# EAGLE design MBC3_1-4 (EAGLE 9.6.2)
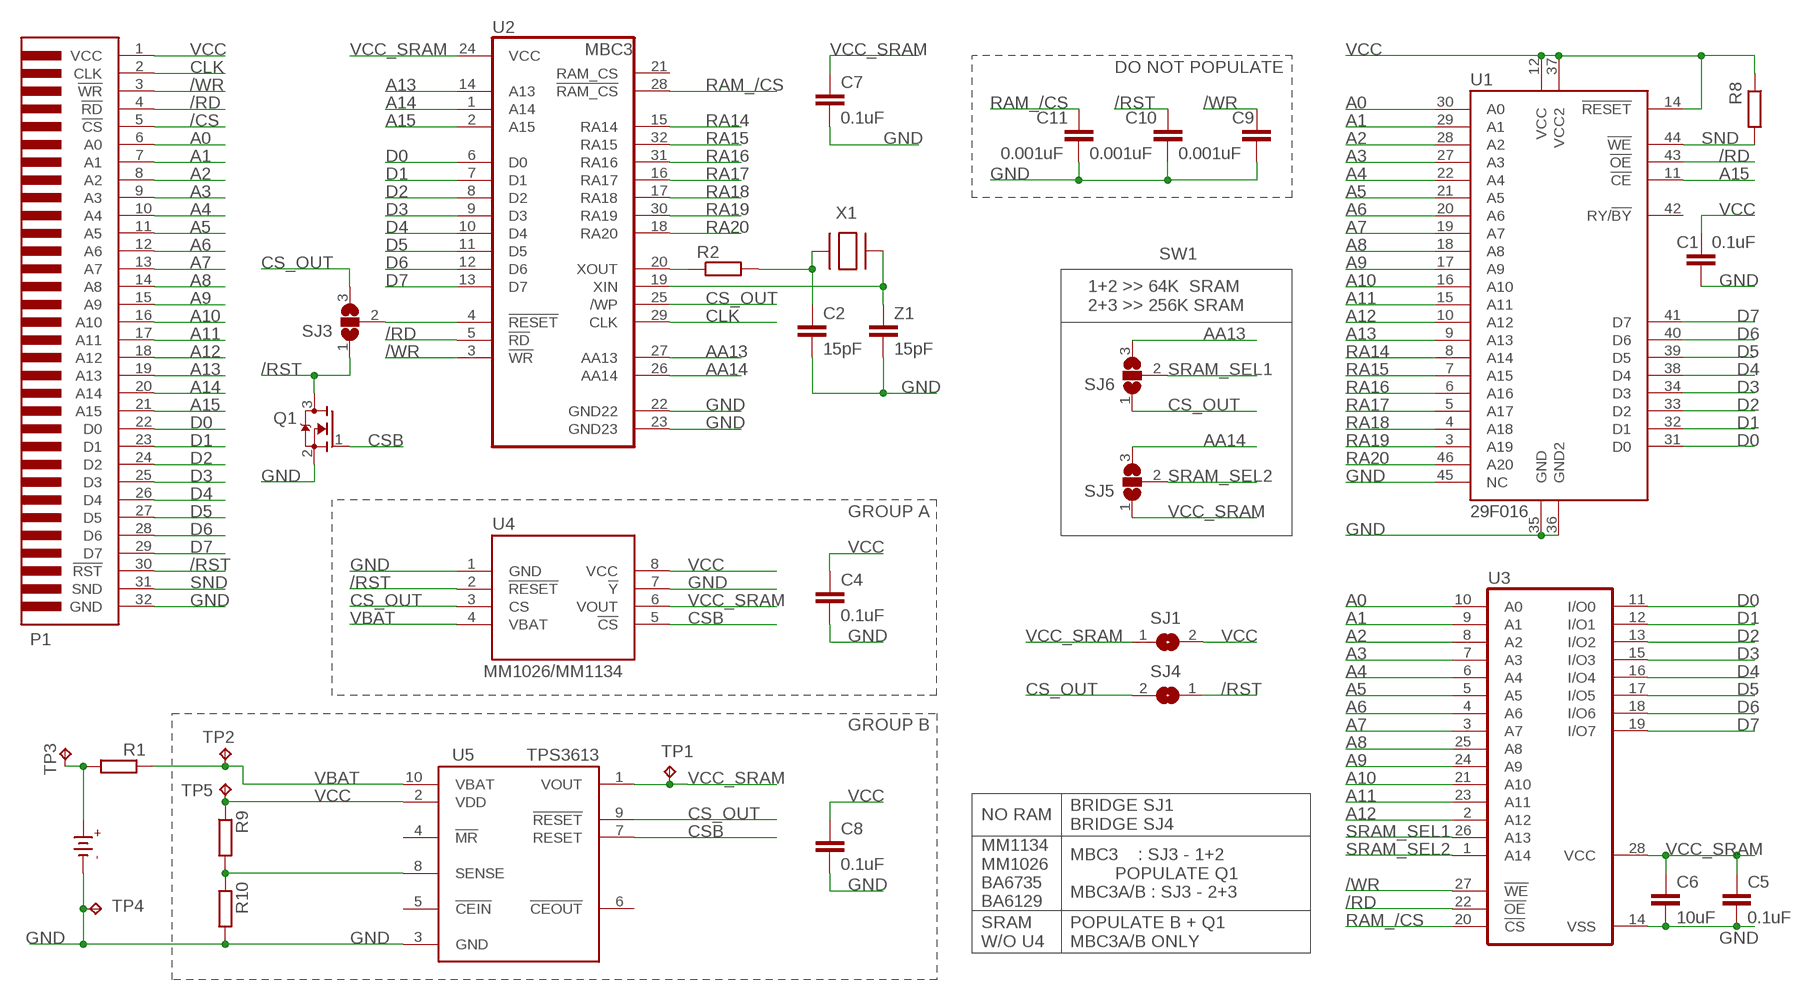
[diagram p0: schematic, sheet 1]

## Parts
B1  CR2025  [CR2025]
C1  0.1uF  C-EUC0603  [C0603]
C2  15pF  C-EUC0603  [C0603]
C4  0.1uF  C-EUC0603  [C0603]
C5  0.1uF  C-EUC0603  [C0603]
C6  10uF  C-EUC0603  [C0603]
C7  0.1uF  C-EUC0603  [C0603]
C8  0.1uF  C-EUC0603  [C0603]
C9  0.001uF  C-EUC0603  [C0603]
C10  0.001uF  C-EUC0603  [C0603]
C11  0.001uF  C-EUC0603  [C0603]
P1  GBC_CARTTAB  [GBC_CART_TABBED]
Q1  2N7002  MOSFET-NREFLOW  [SOT23]
R1  RR0603  [R0603]
R2  RR0603  [R0603]
R8  RR0603  [R0603]
R9  RR0603  [R0603]
R10  RR0603  [R0603]
SJ1  SJ  [SJ]
SJ3  SJ2W  [SJ_2]
SJ4  SJ  [SJ]
SJ5  SJ2W  [SJ_2]
SJ6  SJ2W  [SJ_2]
TP1  TPB1,27  [B1,27]
TP2  TPB1,27  [B1,27]
TP3  TPB1,27  [B1,27]
TP4  TPB1,27  [B1,27]
TP5  TPB1,27  [B1,27]
U1  29F016  [TSOP-48]
U2  MBC3  [QFP-32]
U3  62256_SRAM  [SOP-28L]
U4  MM1134  [SOIC-8]
U5  TPS3613  [MSOP-10]
X1  XTAL-3.2X1.5  [XTAL3215]
Z1  15pF  C-EUC0603  [C0603]

## Nets
/CS: P1.5(!CS)
/RD: P1.4(!RD) U1.43(!OE) U2.5(!RD) U3.22(!OE)
/RST: C10.1 P1.30(!RST) Q1.3(D) SJ3.1 SJ4.1 U4.2(!RESET)
/WR: C9.1 P1.3(!WR) U2.3(!WR) U3.27(!WE)
A0: P1.6(A0) U1.30(A0) U3.10(A0)
A1: P1.7(A1) U1.29(A1) U3.9(A1)
A2: P1.8(A2) U1.28(A2) U3.8(A2)
A3: P1.9(A3) U1.27(A3) U3.7(A3)
A4: P1.10(A4) U1.22(A4) U3.6(A4)
A5: P1.11(A5) U1.21(A5) U3.5(A5)
A6: P1.12(A6) U1.20(A6) U3.4(A6)
A7: P1.13(A7) U1.19(A7) U3.3(A7)
A8: P1.14(A8) U1.18(A8) U3.25(A8)
A9: P1.15(A9) U1.17(A9) U3.24(A9)
A10: P1.16(A10) U1.16(A10) U3.21(A10)
A11: P1.17(A11) U1.15(A11) U3.23(A11)
A12: P1.18(A12) U1.10(A12) U3.2(A12)
A13: P1.19(A13) U1.9(A13) U2.14(A13)
A14: P1.20(A14) U2.1(A14)
A15: P1.21(A15) U1.11(!CE) U2.2(A15)
AA13: SJ6.3 U2.27(AA13)
AA14: SJ5.3 U2.26(AA14)
CLK: P1.2(CLK) U2.29(CLK)
CS_OUT: SJ3.3 SJ4.2 SJ6.1 U2.25(/WP) U4.3(CS) U5.9(!RESET)
CSB: Q1.1(G) U4.5(!CS) U5.7(RESET)
D0: P1.22(D0) U1.31(D0) U2.6(D0) U3.11(I/O0)
D1: P1.23(D1) U1.32(D1) U2.7(D1) U3.12(I/O1)
D2: P1.24(D2) U1.33(D2) U2.8(D2) U3.13(I/O2)
D3: P1.25(D3) U1.34(D3) U2.9(D3) U3.15(I/O3)
D4: P1.26(D4) U1.38(D4) U2.10(D4) U3.16(I/O4)
D5: P1.27(D5) U1.39(D5) U2.11(D5) U3.17(I/O5)
D6: P1.28(D6) U1.40(D6) U2.12(D6) U3.18(I/O6)
D7: P1.29(D7) U1.41(D7) U2.13(D7) U3.19(I/O7)
GND [GND]: B1.- C1.2 C2.2 C4.2 C5.2 C6.2 C7.2 C8.2 C9.2 C10.2 C11.2 P1.32(GND) Q1.2(S) R10.2 TP4.TP U1.35(GND) U1.36(GND2) U1.45(NC) U2.22(GND22) U2.23(GND23) U3.14(VSS) U4.1(GND) U4.7(!Y) U5.3(GND) Z1.2
N$1: SJ3.2 U2.4(!RESET)
N$3 [VCC]: B1.+ R1.2 TP3.TP
N$6: R2.1 U2.20(XOUT)
N$7: C2.1 R2.2 X1.P$2
N$8: U2.19(XIN) X1.P$1 Z1.1
N$10: R9.2 R10.1 U5.8(SENSE)
RA14: U1.8(A14) U2.15(RA14)
RA15: U1.7(A15) U2.32(RA15)
RA16: U1.6(A16) U2.31(RA16)
RA17: U1.5(A17) U2.16(RA17)
RA18: U1.4(A18) U2.17(RA18)
RA19: U1.3(A19) U2.30(RA19)
RA20: U1.46(A20) U2.18(RA20)
RAM_/CS: C11.1 U2.28(!RAM_CS) U3.20(!CS)
SND: P1.31(SND) R8.2 U1.44(!WE)
SRAM_SEL1: SJ6.2 U3.26(A13)
SRAM_SEL2: SJ5.2 U3.1(A14)
VBAT [VCC]: R1.1 TP2.TP U4.4(VBAT) U5.10(VBAT)
VCC [VCC]: C1.1 C4.1 C8.1 P1.1(VCC) R8.1 R9.1 SJ1.2 TP5.TP U1.12(VCC) U1.14(!RESET) U1.37(VCC2) U4.8(VCC) U5.2(VDD)
VCC_SRAM [VCC]: C5.1 C6.1 C7.1 SJ1.1 SJ5.1 TP1.TP U2.24(VCC) U3.28(VCC) U4.6(VOUT) U5.1(VOUT)
Unconnected: U1.42(RY/!BY) U2.21(RAM_CS) U5.4(!MR) U5.5(!CEIN) U5.6(!CEOUT)

## Notes on the sheet
- DO NOT POPULATE
- SW1
- 1+2 >> 64K  SRAM
  2+3 >> 256K SRAM
- GROUP A
- MM1026/MM1134
- GROUP B
- NO RAM
- BRIDGE SJ1
  BRIDGE SJ4
- MM1134
  MM1026
  BA6735
  BA6129
- MBC3    : SJ3 - 1+2
           POPULATE Q1
  MBC3A/B : SJ3 - 2+3
- SRAM
  W/O U4
- POPULATE B + Q1
  MBC3A/B ONLY

## Library data of the parts
B1 = gameboylib:CR2025
C1 C2 C4-C11 Z1 = rcl:C-EU: CAPACITOR, European symbol; SPICEPREFIX: C
P1 = gameboylib:GBC_CART
Q1 = adafruit:MOSFET-N: N-Channel Mosfet 2N7002E - 60V 260mA SOT23 [Digikey: 2N7002ET1GOSTR-ND] - REEL BSH103 - 30V 850mA SOT23 [Digikey: 568-5013-1-ND]
R1 R2 R8-R10 = eagle-ltspice:R: RESISTOR, European symbol; SPICEMODEL: NONE; SPICEPREFIX: R
SJ1 SJ4 = jumper:SJ: SMD solder JUMPER
SJ3 SJ5 SJ6 = jumper:SJ2W: SMD solder JUMPER
TP1-TP5 = testpad:TP: Test pad
U1 = gameboylib:29F016
U2 = gameboylib:MBC3: MBC3; OC_FARNELL: unknown; OC_NEWARK: unknown
U3 = gameboylib:62256_SRAM: MEMORY; MPN: CY62256VNLL-70SNXI; OC_FARNELL: 1650073; OC_NEWARK: 19M2582
U4 = gameboylib:MM1134
U5 = gameboylib:TPS3613
X1 = adafruit:XTAL: Low cost SMT crystals, no capacitors included http://www.ladyada.net/library/eagle

## Net classes
1 VCC: width 0.203 mm
2 GND: width 0.203 mm

## Board
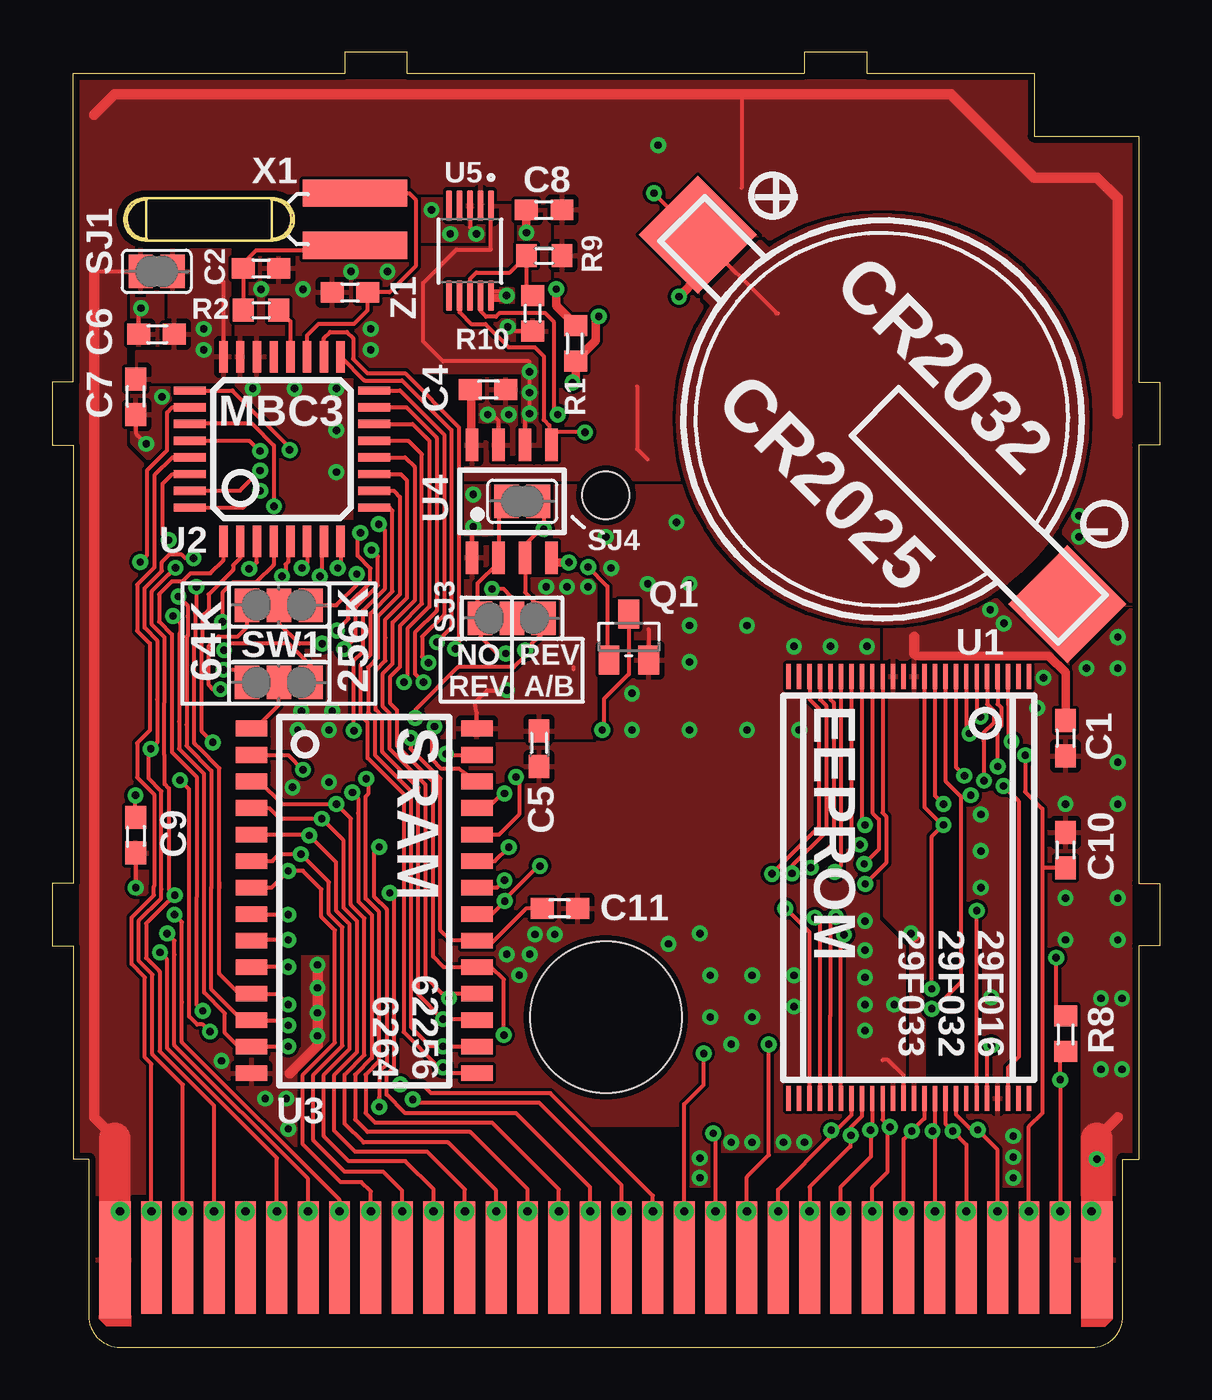
[diagram p1: board, top side]
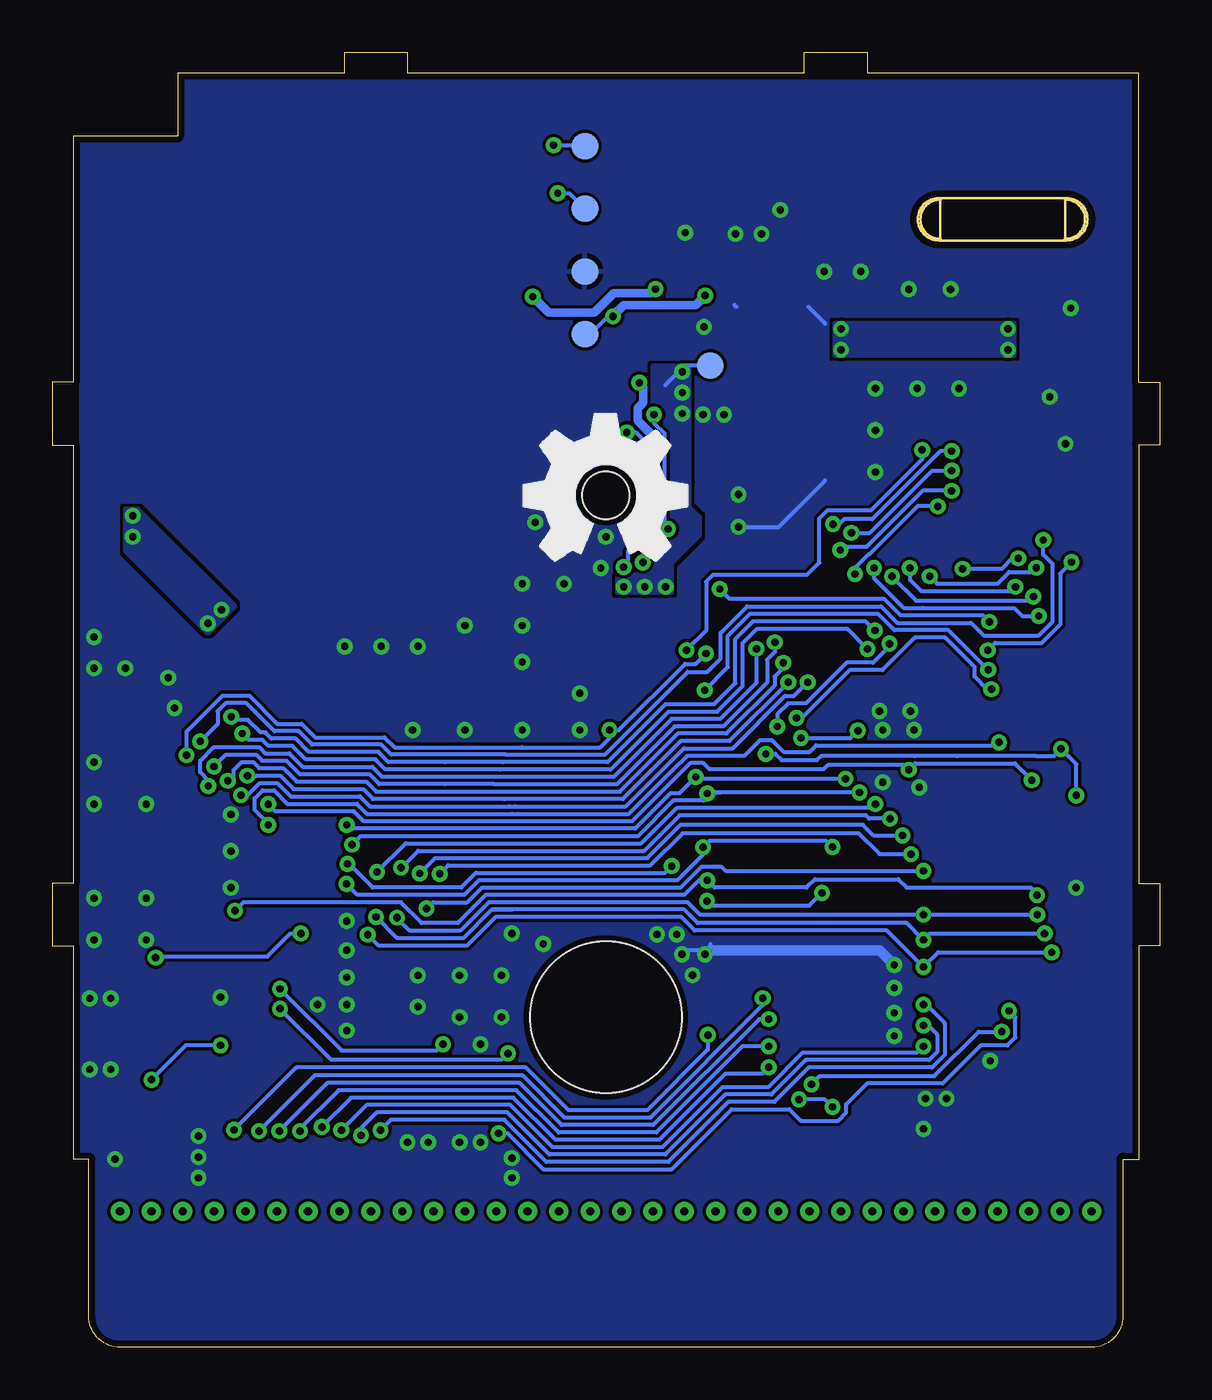
[diagram p2: board, bottom side, seen from below]

Size 53 x 62.01 mm. Coordinates in mm from the lower left corner, seen from the top.
Copper layers (1*16): Top 0.035mm / dielectric 1.5mm / Bottom 0.035mm
Design rules "default *": minimum track width 7mil, minimum drill 13mil, track to track 6mil, track to pad 7mil, pad to pad 7mil, via to via 7mil, smd to smd 5mil, copper to edge 12mil, drill to drill 22mil, minimum pad ring 10mil, minimum via ring 8mil, stop-mask expansion 4mil, vias tented up to drill 14mil, thermal gap 10mil
tKeepout: area -0.8,-1.6 to 55,11; area 0,11 to 3,62; area 50,11 to 53,62; area 3,55.1 to 50,62
tRestrict: area 31.8,8.7 to 36.4,9.2; area 48.4,5.5 to 49.1,15.6; area 11.2,14.4 to 11.8,20.7; area 10.6,21 to 11.3,22.4; area 47.6,0.7 to 50.9,1.2; area 10.5,39 to 14.5,39.5; area 14.5,39.5 to 15,46.5; area 10.1,46.5 to 14.5,47; area 9.3,46.5 to 9.5,48.3; area 10.1,48.1 to 11.9,48.3; area 27.6,6.7 to 34.9,7.6; area 38.8,11.2 to 43.4,12; area 35.1,32.3 to 39.8,32.8; area 46.1,31.4 to 46.9,32; area 35.1,31.4 to 35.9,32; area 35.1,11.9 to 40,12.6; area 11.8,18.9 to 13.2,19.6; area 25.2,10 to 29.9,10.5; area 45.6,7.2 to 46.4,7.6; area 3.5,24.4 to 4.1,24.7; area 9.7,28.9 to 10.4,29.1; area 9.7,27.6 to 10.4,27.9; area 21.8,42.4 to 22.2,42.6; area 23.1,42.4 to 23.4,42.6; area 20.5,43.9 to 20.9,44.1; area 20.5,38.5 to 20.9,38.7; area 23.1,37 to 23.5,37.2; area 45.2,35.3 to 48.8,38.9; area 10.9,60.8 to 42.9,61.3; area 0.7,15 to 1.2,47; area 51.8,14.7 to 52.3,46.7
bRestrict: area 51.8,14.7 to 52.3,46.7; area 0.7,15 to 1.2,47; area 10.9,60.8 to 42.9,61.3

### Footprints (pad centres in the part's own frame; a part is rotated, then mirrored left to right if it is on the bottom)
CR2025 = smd 4 x 4: + -12,0; - 13,0
C0603 = smd 1.1 x 1: 1 -0.85,0; 2 0.85,0
GBC_CART_TABBED = smd 1.5 x 5.6: 1 -23.4,-25.01; 32 23.6,-25.01 | smd 1 x 5.4: 2 -21.65,-24.91; 3 -20.15,-24.91; 4 -18.65,-24.91; 5 -17.15,-24.91; 6 -15.65,-24.91; 7 -14.15,-24.91; 8 -12.65,-24.91; 9 -11.15,-24.91; 10 -9.65,-24.91; 11 -8.15,-24.91; 12 -6.65,-24.91; 13 -5.15,-24.91; 14 -3.65,-24.91; 15 -2.15,-24.91; 16 -0.65,-24.91; 17 0.85,-24.91; 18 2.35,-24.91; 19 3.85,-24.91; 20 5.35,-24.91; 21 6.85,-24.91; 22 8.35,-24.91; 23 9.85,-24.91; 24 11.35,-24.91; 25 12.85,-24.91; 26 14.35,-24.91; 27 15.85,-24.91; 28 17.35,-24.91; 29 18.85,-24.91; 30 20.35,-24.91; 31 21.85,-24.91 | drill 0.4: P$1 -21.65,-22.7; P$2 -18.65,-22.7; P$3 -15.65,-22.7; P$4 -12.65,-22.7; P$5 -9.65,-22.7; P$6 -6.65,-22.7; P$7 -3.65,-22.7; P$8 -0.65,-22.7; P$9 2.35,-22.7; P$10 5.35,-22.7; P$11 8.35,-22.7; P$12 11.35,-22.7; P$13 14.35,-22.7; P$14 17.35,-22.7; P$15 20.35,-22.7; P$16 23.35,-22.7; P$17 21.85,-22.7; P$18 18.85,-22.7; P$19 15.85,-22.7; P$20 12.85,-22.7; P$21 9.85,-22.7; P$22 6.85,-22.7; P$23 3.85,-22.7; P$24 0.85,-22.7; P$25 -2.15,-22.7; P$26 -5.15,-22.7; P$27 -8.15,-22.7; P$28 -11.15,-22.7; P$29 -14.15,-22.7; P$30 -17.15,-22.7; P$31 -20.15,-22.7; P$32 -23.15,-22.7 | hole 7.25: 0.1,-13.41 | hole 2.25: 0.1,11.585
SOT23 = smd 1 x 1.4: 1 -0.95,-1.1; 2 0.95,-1.1; 3 0,1.1
R0603 = smd 1 x 1.1: 1 -0.85,0; 2 0.85,0
SJ = smd 1.168 x 1.6: 1 -0.762,0; 2 0.762,0
SJ_2 = smd 1.168 x 1.6: 1 -1.524,0; 2 0,0; 3 1.524,0
B1,27 = smd 1.27 x 1.27: TP 0,0
TSOP-48 = smd 1.2 x 0.21: 1 -10.1,5.75; 2 -10.1,5.25; 3 -10.1,4.75; 4 -10.1,4.25; 5 -10.1,3.75; 6 -10.1,3.25; 7 -10.1,2.75; 8 -10.1,2.25; 9 -10.1,1.75; 10 -10.1,1.25; 11 -10.1,0.75; 12 -10.1,0.25; 13 -10.1,-0.25; 14 -10.1,-0.75; 15 -10.1,-1.25; 16 -10.1,-1.75; 17 -10.1,-2.25; 18 -10.1,-2.75; 19 -10.1,-3.25; 20 -10.1,-3.75; 21 -10.1,-4.25; 22 -10.1,-4.75; 23 -10.1,-5.25; 24 -10.1,-5.75; 25 10.1,-5.75; 26 10.1,-5.25; 27 10.1,-4.75; 28 10.1,-4.25; 29 10.1,-3.75; 30 10.1,-3.25; 31 10.1,-2.75; 32 10.1,-2.25; 33 10.1,-1.75; 34 10.1,-1.25; 35 10.1,-0.75; 36 10.1,-0.25; 37 10.1,0.25; 38 10.1,0.75; 39 10.1,1.25; 40 10.1,1.75; 41 10.1,2.25; 42 10.1,2.75; 43 10.1,3.25; 44 10.1,3.75; 45 10.1,4.25; 46 10.1,4.75; 47 10.1,5.25; 48 10.1,5.75
QFP-32 = smd 0.4 x 1.524: 1 -2.8,-4.415; 2 -2,-4.415; 3 -1.2,-4.415; 4 -0.4,-4.415; 5 0.4,-4.415; 6 1.2,-4.415; 7 2,-4.415; 8 2.8,-4.415; 17 2.8,4.415; 18 2,4.415; 19 1.2,4.415; 20 0.4,4.415; 21 -0.4,4.415; 22 -1.2,4.415; 23 -2,4.415; 24 -2.8,4.415 | smd 1.524 x 0.4: 9 4.415,-2.8; 10 4.415,-2; 11 4.415,-1.2; 12 4.415,-0.4; 13 4.415,0.4; 14 4.415,1.2; 15 4.415,2; 16 4.415,2.8; 25 -4.415,2.8; 26 -4.415,2; 27 -4.415,1.2; 28 -4.415,0.4; 29 -4.415,-0.4; 30 -4.415,-1.2; 31 -4.415,-2; 32 -4.415,-2.8
SOP-28L = smd 0.75 x 1.5: 1 -7.62,-5.457; 2 -6.35,-5.457; 3 -5.08,-5.457; 4 -3.81,-5.457; 5 -2.54,-5.457; 6 -1.27,-5.457; 7 0,-5.457; 8 1.27,-5.457; 9 2.54,-5.457; 10 3.81,-5.457; 11 5.08,-5.457; 12 6.35,-5.457; 13 7.62,-5.457; 14 8.89,-5.457; 15 8.89,5.33; 16 7.62,5.33; 17 6.35,5.33; 18 5.08,5.33; 19 3.81,5.33; 20 2.54,5.33; 21 1.27,5.33; 22 0,5.33; 23 -1.27,5.33; 24 -2.54,5.33; 25 -3.81,5.33; 26 -5.08,5.33; 27 -6.35,5.33; 28 -7.62,5.33
SOIC-8 = smd 0.6 x 1.55: 1 1.905,2.7; 2 0.635,2.7; 3 -0.635,2.7; 4 -1.905,2.7; 5 -1.905,-2.7; 6 -0.635,-2.7; 7 0.635,-2.7; 8 1.905,-2.7
MSOP-10 = smd 1.47 x 0.28: 1 -2.15,1; 2 -2.15,0.5; 3 -2.15,0; 4 -2.15,-0.5; 5 -2.15,-1; 6 2.15,-1; 7 2.15,-0.5; 8 2.15,0; 9 2.15,0.5; 10 2.15,1
XTAL3215 = smd 1.3 x 5: P$1 1.25,0.5; P$2 -1.25,0.5

### Placement (x,y rotation side)
B1  39.39,44.79 315 top
C1  48.5,29.16 270 top
C2  10,51.66 0 top
C4  20.85,45.86 0 top
C5  23.3,28.66 270 top
C6  5,48.51 180 top
C7  4,45.51 270 top
C8  23.55,54.46 180 top
C9  4,24.51 270 top
C10  48.5,23.81 90 top
C11  24.3,21.01 0 top
P1  26.4,29.21 0 top
Q1  27.6,34.01 0 top
R1  25.05,48.06 90 top
R2  10,49.66 180 top
R8  48.5,15.01 270 top
R9  23.55,52.26 180 top
R10  23,49.51 270 top
SJ1  5,51.51 180 top
SJ3  22,34.91 0 top
SJ4  22.5,40.51 0 top
SJ5  10.85,31.84 0 top
SJ6  10.85,35.53 0 top
TP1  21.5,47.01 0 bottom
TP2  27.5,48.51 0 bottom
TP3  27.5,54.51 0 bottom
TP4  27.5,51.51 0 bottom
TP5  27.5,57.51 0 bottom
U1  41,22.01 270 top
U2  11,43.01 0 top
U3  15,22.01 270 top
U4  22,40.51 180 top
U5  20,52.51 270 top
X1  15,54.01 90 top
Z1  14.25,50.51 180 top

### Tracks (layer width: path | path; a pad name or v marks a point on that pad's centre or on a via)
/RD  (via drill 0.35)
  Top 0.2: P1.4 7.75,11.57 5.14,14.17 5.14,18 4.5,18.64 4.5,20.29 5.58,21.37 5.59,21.37 v5.87,21.64 5.58,21.93 5.58,26.76 5.38,26.96 5.38,28.35 5.37,28.36 5.37,30.88 5.38,30.89 5.38,33.99 4.77,34.6 4.77,36.2 5.58,37.02 5.6,37.02 v5.9,37.32 v5.89,37.33 | U3.22 21.3,22.01 v21.65,22.36 | U2.5 11.3,38.5 11.3,37.62 11.17,37.49 11.17,37.09 v10.99,36.92 | U1.43 v44.25,20.91
  Bottom 0.2: v5.87,21.64 5.87,21.71 6.17,22.01 12.1,22.01 12.5,22.41 16.5,22.41 16.9,22.01 21.3,22.01 v21.65,22.36 22.05,22.36 22.75,21.66 32.25,21.66 33.59,20.32 35.33,20.32 36.32,21.31 43.85,21.31 v44.25,20.91 | v5.9,37.32 6.1,37.12 7.2,37.12 7.75,36.57 10.64,36.57 v10.99,36.92
/RST  (via drill 0.35)
  Top 0.2: P1.30 46.75,10.57 47.39,11.21 47.39,23.02 47.39,25.78 46.57,26.6 v46.57,28.35 46.65,28.27 | v21.71,33.22 21.29,33.22 20.5,34.01 20.5,34.89 SJ3.1 20.35,35.04 20.35,36.56 21.36,37.58 U4.2 21.36,40.14 SJ4.1 | Q1.3 27.6,32.23 26.4,31.04 26.4,29.63 v26.32,29.55
  Top 0.203: C10.1 47.45,22.96 47.39,23.02
  Bottom 0.2: v46.57,28.35 46.57,29.47 44.85,31.2 43.56,31.2 42.22,29.85 41.06,29.85 40.42,29.21 37.1,29.21 36.62,28.73 30.52,28.73 30.51,28.72 26.78,28.72 26.32,29.18 v26.32,29.55 25.87,29.55 22.71,32.72 22.21,32.72 v21.71,33.22
/WR  (via drill 0.35)
  Top 0.2: v18.85,28.41 18.9,28.36 U3.27 | P1.3 6.25,12.57 4.79,14.03 4.79,17.85 4.15,18.49 4.15,20.43 5.21,21.5 5.21,21.92 5.23,21.93 5.23,26.62 4.61,27.24 4.61,28.55 v4.71,28.65 5.02,28.96 5.02,31.03 5.02,33.84 4.42,34.45 4.42,36.35 5.24,37.18 5.24,37.59 5.63,37.98 6.17,37.98 6.37,37.78 v6.76,37.78 | U2.3 9.8,37.59 9.45,37.25 v9.43,37.27
  Top 0.203: C9.1 3.98,25.38 v3.98,26.43
  Bottom 0.2: 18.85,28.36 v18.85,28.41 18.39,28.41 18.09,28.11 16.4,28.11 16.2,28.31 11.73,28.31 11.72,28.31 9.7,28.31 5.89,28.31 | v6.76,37.78 7.04,37.78 7.55,37.27 v9.43,37.27 | v3.98,26.43 3.98,27.92 v4.71,28.65 5.06,28.31 5.89,28.31 | 5.89,28.31
A0  (via drill 0.35)
  Top 0.2: P1.6 10.75,9.06 5.5,14.32 5.5,18.57 v5.16,18.91 | v11.3,18.21 9.8,18.21 U3.10 | v37.9,19.75 37.75,19.6 U1.30
  Bottom 0.2: v11.3,18.21 10.6,18.91 v5.16,18.91 | v37.9,19.75 37.4,19.25 33.13,19.25 32.69,19.7
  Bottom 0.203: v11.3,18.21 13.04,19.95 22.25,19.95 22.9,20.6 31.78,20.6 32.69,19.7
A1  (via drill 0.35)
  Top 0.2: v11.3,19.51 9.83,19.51 U3.9 | v37.5,20.61 37.24,20.35 37.24,15.88 37.25,15.88 U1.29 | P1.7 12.25,8.06 5.85,14.46 5.85,18.81 5.85,19.46 v5.5,19.81
  Bottom 0.2: v11.3,19.51 11,19.81 v5.5,19.81 | v37.5,20.61 36.5,19.61 33.3,19.61 31.95,20.96 31,20.96
  Bottom 0.203: v11.3,19.51 12.1,20.31 22.1,20.31 22.75,20.96 31,20.96 31.95,20.96
A2  (via drill 0.35)
  Top 0.2: P1.8 13.75,7.06 6.2,14.61 6.2,16.53 6.2,20.36 v5.85,20.71 | v11.3,20.71 9.82,20.71 U3.8 | v36.5,20.57 36.56,20.57 36.75,20.38 U1.28
  Bottom 0.2: v5.85,20.71 v11.3,20.71 21.98,20.71 22.58,21.31 32.1,21.31 33.44,19.97 35.9,19.97 v36.5,20.57
A3  (via drill 0.35)
  Top 0.2: P1.9 15.25,7.46 14.8,7.91 13.8,7.91 12,9.71 12,13.05 13.53,14.58 13.53,19.96 12.89,20.61 12.89,21.92 12,22.81 v11.3,22.81 10.5,22.01 U3.7 | v35.09,21.01 35.12,21.01 36.25,19.87 U1.27
  Bottom 0.2: v35.09,21.01 34.78,21.31 33.13,21.31 32.42,22.01 22.92,22.01 21.92,23.02 20.98,23.02 20.77,22.81 v11.3,22.81
A4  (via drill 0.35)
  Top 0.2: P1.10 16.75,7.5 15.84,8.41 14,8.41 12.5,9.91 12.5,13.05 13.89,14.43 13.89,20.11 13.24,20.75 13.24,22.27 v11.9,23.61 | v34.45,22.67 36.69,24.91 36.69,30.58 36.25,31.02 U1.22
  Top 0.203: U3.6 10.54,23.28 10.87,23.61 v11.9,23.61
  Bottom 0.2: 11.8,23.51 v11.9,23.61 13.4,23.61 14.4,24.61 22.83,24.61 24.37,23.07 34.05,23.07 v34.45,22.67
A5  (via drill 0.35)
  Top 0.2: P1.11 18.25,7.56 16.9,8.91 14.2,8.91 13,10.11 13,13.05 14.24,14.29 14.24,20.25 13.59,20.9 13.59,23.22 v12.3,24.51 | v35.41,22.69 35.41,23.04 37.05,24.68 37.05,30.72 36.75,31.02 U1.21
  Top 0.203: U3.5 12.26,24.55 v12.3,24.51
  Bottom 0.2: v12.3,24.51 13.7,24.51 14.2,25.01 22.93,25.01 24.52,23.42 34.67,23.42 v35.41,22.69
A6  (via drill 0.35)
  Top 0.2: P1.12 19.75,7.56 17.95,9.36 14.5,9.36 13.5,10.36 13.5,13.05 14.59,14.14 14.59,20.4 13.94,21.05 13.94,24.27 v12.9,25.31 | v36.31,22.96 36.31,23.06 37.4,24.15 37.4,30.87 37.25,31.02 U1.20
  Top 0.203: U3.4 10.39,25.82 10.9,25.31 v12.9,25.31
  Bottom 0.2: v12.9,25.31 13.9,25.31 14.06,25.47 22.97,25.47 24.66,23.78 35.49,23.78 v36.31,22.96
A7  (via drill 0.35)
  Top 0.2: P1.13 21.25,7.51 18.95,9.81 14.9,9.81 14,10.71 14,13.05 14.94,14 14.94,20.54 14.29,21.19 14.29,25.32 v13.6,26.01 | v37.46,22.76 37.75,23.05 U1.19
  Top 0.203: U3.3 9.92,27.09 11,26.01 v13.6,26.01
  Bottom 0.2: v13.6,26.01 13.79,25.82 23.12,25.82 24.81,24.13 36.09,24.13 v37.46,22.76
A8  (via drill 0.35)
  Top 0.2: P1.14 22.75,7.56 20,10.31 15.1,10.31 14.5,10.91 14.5,13.05 15.29,13.85 15.29,20.69 14.65,21.34 14.65,25.56 14.65,26.29 v14.37,26.57 | U3.25 20.85,25.82 21.55,26.52 v21.65,26.52 | v38.66,24.06 38.25,24.47 U1.18
  Bottom 0.2: 21,26.57 21.44,26.57 21.84,26.17 23.27,26.17 24.95,24.48 38.23,24.48 v38.66,24.06
  Bottom 0.203: v14.37,26.57 21,26.57 21.6,26.57 v21.65,26.52
A9  (via drill 0.35)
  Top 0.2: P1.15 24.25,7.56 21.05,10.76 15.45,10.76 | U3.24 21.39,24.55 22.35,25.51 22.35,27.16 v22.2,27.31 | 15,11.24 15,13.06 15.65,13.7 15.65,20.84 15,21.48 15,26.01 | v38.91,25.01 38.75,25.17 U1.17
  Top 0.203: 15,25.71 15,26.01 15,26.37 15.12,26.49 15.12,27.13 v15.03,27.22 | 15,11.24 15,11.21 15.45,10.76
  Bottom 0.2: v22.2,27.31 22.99,26.52 23.41,26.52 25.1,24.83 38.73,24.83 v38.91,25.01
  Bottom 0.203: v15.03,27.22 22.11,27.22 v22.2,27.31
A10  (via drill 0.35)
  Top 0.2: P1.16 25.75,7.66 22.2,11.21 16.9,11.21 16,12.11 16,13.06 16.36,13.42 16.36,21.55 v16.16,21.75 | U3.21 20.09,20.75 21.07,20.75 21.66,21.35 | v23.35,23.04 23.26,23.04 21.66,21.45 v21.66,21.37 | v38.86,23.15 39.56,23.85 39.56,25.28 39.25,25.59 U1.16
  Top 0.203: v21.66,21.37 21.66,21.35
  Bottom 0.2: v23.35,23.04 23.67,22.72 32.72,22.72 33.42,22.02 37.66,22.02 38.79,23.15 v38.86,23.15
  Bottom 0.203: v16.16,21.75 16.76,21.15 21.46,21.15 21.46,21.17 v21.66,21.37
A11  (via drill 0.35)
  Top 0.2: P1.17 27.25,7.76 23.3,11.71 17.41,11.71 v17.26,11.87 | v38.92,22.18 39.91,23.18 39.91,25.43 39.75,25.59 U1.15 | v15.66,23.95 15.66,23.93 15.4,23.68 15.4,21.58 16,20.98 16,13.56 15.65,13.21 15.65,11.96 15.66,11.96 v15.66,11.51
  Top 0.203: U3.23 21.19,23.28 v21.85,23.94
  Bottom 0.2: v15.66,11.51 16.01,11.87 v17.26,11.87 | v38.92,22.18 38.4,21.66 33.27,21.66 32.57,22.37 23.07,22.37 21.85,23.59 v21.85,23.94
  Bottom 0.203: v15.66,23.95 15.96,24.26 21.54,24.26 v21.85,23.94
A12  (via drill 0.35)
  Top 0.2: P1.18 28.75,7.26 23.85,12.16 18.13,12.16 17.7,12.59 v16.66,12.59 | U3.2 11.29,28.36 v12,27.65 | v42.66,26.01 42.25,26.42 U1.10 | v7.56,15.11 7.21,15.45 6.94,15.45 6.55,15.84 6.55,16.38 6.56,16.39 6.56,26.72 v6.12,27.15
  Bottom 0.2: v16.66,12.59 16.26,12.99 10.78,12.99 8.66,15.11 v7.56,15.11 | 12.23,27.88 v12,27.65 11.7,27.95 6.92,27.95 v6.12,27.15 | 23.18,27.26 22.47,27.97 21.83,27.97 | 25.25,25.19 38.08,25.19
  Bottom 0.203: 12.23,27.88 15.88,27.88 16.08,27.68 21.54,27.68 21.83,27.97 | 23.18,27.26 25.25,25.19 | v42.66,26.01 42.31,25.67 38.56,25.67 38.08,25.19
A13  (via drill 0.35)
  Top 0.2: P1.19 30.25,11.63 31.18,12.57 v31.18,14.07 | v42.1,16.21 42.23,16.21 43.51,17.49 43.51,26.36 42.75,27.12 U1.9 | 17,34.41 17,32.01 v16.84,31.85
  Top 0.203: 43.51,26.36 43.89,26.36 v43.97,26.43 | U2.14 17.25,44.21 18.05,43.41 18.05,35.46 17,34.41
  Bottom 0.2: v31.18,14.07 31.49,13.76 39.65,13.76 v42.1,16.21 | 31.1,25.9 30.85,25.9 25.54,25.9 22.77,28.68 20.44,28.68 17.93,31.19 17.5,31.19 v16.84,31.85
  Bottom 0.203: v43.97,26.43 43.66,26.43 43.07,27.02 42.24,27.02 41.59,26.38 38.27,26.38 37.79,25.9 31.1,25.9
A14  (via drill 0.35)
  Top 0.2: 6.91,16.41 v7.21,16.11 | 6.91,21.54 6.91,27.32 5.72,28.5 5.72,30.1 5.73,30.1 5.73,34.14 5.12,34.74 5.12,36.06 5.73,36.67 6.23,36.67 6.63,37.07 7.57,37.07 8.2,37.7 U2.1
  Top 0.203: P1.20 31.75,10.13 v31.64,10.24 | 6.91,16.41 6.91,21.54
  Bottom 0.2: 14,12.63 10.38,12.63 8.56,14.45 7.28,14.45 6.9,14.84 6.9,15.8 v7.21,16.11
  Bottom 0.203: v31.64,10.24 31.61,10.26 31.23,10.26 29.49,8.52 23.36,8.52 20.49,11.4 17.71,11.4 17.17,10.85 15.38,10.85 15,11.24 15,11.64 14,12.63
A15  (via drill 0.35)
  Top 0.2: P1.21 33.25,8.16 34.3,9.21 v34.3,14.51 | 42.6,25.01 41.75,25.86 U1.11 | 42.6,25.01 42.6,24.96 42.1,24.46 v42.1,17.16 | 42.6,25.01 v42.66,25.01 | U2.2 9,37.8 8.66,37.45 8.66,37.24 | 7.49,35.31 7.19,35.01 7.19,33.77 7.14,33.72 7.14,29.52
  Top 0.203: 8.66,37.24 8.66,37.22 7.49,36.05 7.49,35.31 | 7.14,29.52 v7.69,28.97
  Bottom 0.2: v42.1,17.16 39.15,14.21 34.6,14.21 v34.3,14.51 | v42.66,25.01 42.66,25.08 43.31,25.74 43.31,26.28 42.93,26.67 42.38,26.67 41.74,26.02 38.42,26.02 37.94,25.54 31,25.54 | 18.55,29.07 18,28.51 16.74,28.51 16.44,28.82 7.83,28.82 v7.69,28.97
  Bottom 0.203: 18.55,29.07 19.12,29.07 19.87,28.32 22.62,28.32 23.32,27.62 25.4,25.54 30.7,25.54 31,25.54
AA13  (via drill 0.35)
  Top 0.2: v14.57,37.03 14.57,36.51 13.6,35.53 SJ6.3 | U2.27 9.57,44.22 10.61,43.18 v10.61,40.28 v10.61,40.27
  Bottom 0.2: v10.61,40.27 11.58,40.27 13.89,37.97 13.94,37.97 14.57,37.33 v14.57,37.03
AA14  (via drill 0.35)
  Top 0.2: SJ5.3 12.36,31.85 12.36,32.66 11.33,33.69 8.53,33.69 v8.22,33.38 | U2.26 5.75,45.01 5.5,44.76 5.5,42.96 4.54,42 4.54,37.92 v4.21,37.59
  Bottom 0.2: v8.22,33.38 7.87,33.73 5.64,33.73 4.76,34.61 4.76,37.05 v4.21,37.59
CLK
  Top 0.2: P1.2 4.75,13.57 4.44,13.88 4.44,17.7 3.79,18.35 3.79,20.58 4.86,21.65 4.86,22.06 4.88,22.08 4.88,26.47 4.06,27.29 4.06,28.93 4.67,29.54 4.67,31.18 4.67,33.7 4.06,34.31 4.06,36.52 4.89,37.35 4.89,41.75 5.75,42.61 U2.29
CS_OUT  (via drill 0.35)
  Top 0.2: 22.64,38.41 U4.3 | 23.52,35.34 23.52,35.26 | 23.52,35.26 SJ3.3 23.52,34.26 v22.64,33.38 22.64,33.11 22.1,32.56 19.42,32.56 17.38,30.52 v17.38,30.13 | U2.25 8.63,45.81 11.36,43.07 v11.36,42.97 | U4.3 22.64,38.42 23.43,39.22 23.43,39.26 23.45,39.26 v23.53,39.18 23.53,40.24 SJ4.2 | v24.2,44.66 24,44.86 24,49.11 23.6,49.51 21.4,49.51 21.23,49.35 20.77,49.35 20.5,49.61 U5.9 | U4.3 22.64,36.15 23.52,35.26 | 7.49,33.43 7.49,33.57 7.96,34.04 8.88,34.04 9.33,34.49 9.33,35.26
  Top 0.203: 9.33,35.26 SJ6.1 | 7.49,33.43 7.49,31.71 7.7,31.51 v8.05,31.51
  Bottom 0.2: v11.36,42.97 11.36,42.54 13.83,40.07 15.9,40.07 16.29,39.68 16.29,37.57 16.88,36.98 21.38,36.98 21.71,36.65 21.71,34.31 v22.64,33.38 | v8.05,31.51 8.25,31.51 8.85,32.11 8.85,32.57 10.26,33.98 11.71,33.98 13.27,32.42 14.83,32.42 17.12,30.13 v17.38,30.13 | v23.53,39.18 23.69,39.34 23.69,43.75 24.2,44.26 v24.2,44.66
CSB  (via drill 0.35)
  Top 0.2: Q1.1 26.57,32.98 26.57,36.44 v25.65,37.36 | v25.5,43.81 24.08,43.81 23.91,43.64 U4.5 23.8,43.21 23.8,44.13 23.52,44.41 23.52,47.46 23.1,47.88 21.84,47.88 20.73,49 20.07,49 19.5,49.56 U5.7
  Bottom 0.2: v25.5,43.81 25.07,43.81 24.6,43.34 24.6,39.96
  Bottom 0.203: v25.65,37.36 25.45,37.56 25.45,38.11 25.1,38.46 25.1,39.46 24.6,39.96
D0  (via drill 0.35)
  Top 0.2: U3.11 10.78,16.93 v11.3,16.41 | P1.22 34.75,7.55 37.29,10.09 v37.29,10.39 37.53,10.39 38.25,11.11 U1.31 | 8,22.01 8,27.72 7.03,28.7 | U2.6 12.2,37.56 v11.95,37.31 | v6.9,36.41 6.99,36.32 | 6.84,35.17 6.84,35.16 6.84,33.92 6.79,33.87 6.79,29.67 6.78,29.66 6.78,28.94 6.83,28.9
  Top 0.203: U3.11 8.95,16.93 8,17.88 8,22.01 8,22.25 | v6.9,36.41 6.9,35.23 6.84,35.17 6.83,35.16 | 6.83,28.9 7.03,28.7
  Bottom 0.2: v11.3,16.41 11.17,16.41 10.29,15.53 10.29,13.99 10.88,13.4 16.78,13.4 18.44,11.75 20.63,11.75 23.5,8.88 29.35,8.88 31.36,10.9 36.79,10.9 v37.29,10.39 | v11.95,37.31 11.95,36.76 11.4,36.21 7.1,36.21 v6.9,36.41
D1  (via drill 0.35)
  Top 0.2: U3.12 11.05,15.66 v11.3,15.41 | P1.23 36.25,7.67 38.2,9.62 38.2,10.12 v38.23,10.14 38.23,10.54 38.75,11.06 U1.32 | 7.62,22.01 7.62,27.61 6.43,28.8 6.43,29.81 6.43,34.02 6.48,34.06 6.48,35 6.48,35.01 6.48,35.51 v6.04,35.95 | v12.81,36.91 12.9,36.91 12.9,38.5 U2.7
  Top 0.203: U3.12 9.09,15.66 7.62,17.13 7.62,22.01 7.62,22.03
  Bottom 0.2: v11.3,15.41 11.07,15.41 10.64,14.98 10.64,14.14 11.03,13.75 16.93,13.75 18.58,12.1 20.78,12.1 23.65,9.23 29.2,9.23 31.22,11.25 37.47,11.25 38.23,10.49 v38.23,10.14 | v12.81,36.91 11.65,35.75 6.34,35.75 6.14,35.95 v6.04,35.95
D2  (via drill 0.35)
  Top 0.2: P1.24 37.75,7.69 39.18,9.12 39.18,10.38 v39.16,10.4 39.25,10.49 U1.33 | U3.13 11.28,14.39 v11.3,14.41 | 7.26,21.78 7.26,27.46 6.08,28.65 6.08,29.95 6.08,29.96 6.08,34.16 6.12,34.2 6.12,34.67 v5.78,35.02 | U2.8 13.8,37.44 v13.67,37.31
  Top 0.203: U3.13 8.92,14.39 8.27,15.04 8.27,15.98 7.26,16.98 7.26,21.78
  Bottom 0.2: v11.3,14.41 11.6,14.11 17.07,14.11 18.73,12.45 20.93,12.45 23.8,9.58 29.05,9.58 31.07,11.6 37.96,11.6 v39.16,10.4 | v5.78,35.02 6.58,35.02 6.96,35.39 11.35,35.39 11.35,35.4 12.24,35.4 13.67,36.82 v13.67,37.31
D3  (via drill 0.35)
  Top 0.2: U3.15 18.99,13.12 v18.7,13.41 | P1.25 39.25,7.66 39.97,8.38 39.97,10.42 v40.09,10.55 39.75,10.89 U1.34 | 18.5,13.41 16.81,15.1 16.81,26.5 15.1,28.22 15.1,29.92 14.77,30.24 14.77,32.7 15.24,33.17 15.24,33.68 15.24,35.14 16.29,36.19 16.29,40.06 16.14,40.21 U2.9
  Top 0.203: v18.7,13.41 18.5,13.41
  Bottom 0.2: v18.7,13.41 19,13.11 20.77,13.11 23.94,9.94 28.91,9.94 30.93,11.95 38.69,11.95 v40.09,10.55
D4  (via drill 0.35)
  Top 0.2: U3.16 18.72,14.39 v18.7,14.41 | P1.26 40.75,9.97 v41.14,10.35 v41.15,10.35 41.75,10.96 U1.38 | U2.10 16.35,41.01 16.64,40.72 16.64,36.05 15.59,35 15.59,33.83 15.59,33.82 15.59,33.02 15.12,32.56 15.12,30.39 15.45,30.06 15.45,28.36 17.17,26.64
  Top 0.203: v18.7,14.41 18.1,14.41 17.17,15.34 17.17,26.64
  Bottom 0.2: v18.7,14.41 19.97,14.41 24.09,10.29 28.76,10.29 30.78,12.31 39.29,12.31 41.15,10.45 v41.15,10.35
D5  (via drill 0.35)
  Top 0.2: U3.17 20.03,15.71 v18.7,15.71 17.52,16.89 17.52,26.79 15.8,28.51 15.8,30.21 15.48,30.53 15.48,32.41 15.94,32.88 15.94,33.97 15.94,34.85 16.99,35.9 16.99,41.51 16.69,41.81 U2.11 | P1.27 42.25,10.23 v42.13,10.35 42.25,10.48 U1.39
  Bottom 0.2: v18.7,15.71 19.16,15.71 24.23,10.64 28.62,10.64 30.63,12.66 39.83,12.66 v42.13,10.35
D6  (via drill 0.35)
  Top 0.2: v18.99,16.72 19.19,16.92 U3.18 18.68,16.93 17.88,17.73 17.88,26.93 16.15,28.66 16.15,30.36 15.83,30.68 15.83,32.27 16.3,32.73 16.3,34.12 16.29,34.12 16.29,34.7 17.34,35.75 17.34,42.16 16.89,42.61 U2.12 | P1.28 43.75,9.7 v43.1,10.35 42.75,10.7 U1.40
  Bottom 0.2: v18.99,16.72 18.99,16.38 24.38,10.99 28.47,10.99 30.49,13.01 40.44,13.01 v43.1,10.35
D7  (via drill 0.35)
  Top 0.2: P1.29 45.25,4.9 45.23,4.92 45.23,9.48 v44.3,10.41 44,10.41 43.25,11.16 U1.41 | v21.62,14.95 21.62,17.6 21.02,18.2 U3.19 18.74,18.2 18.23,18.71 18.23,27.08 16.51,28.8 16.51,30.5 16.18,30.83 16.18,32.12 16.65,32.59 16.65,34.26 16.65,34.56 17.7,35.61 17.7,42.76 17.05,43.41 U2.13
  Bottom 0.2: v21.62,14.95 21.62,14.25 24.52,11.35 28.28,11.35 30.33,13.4 41.31,13.4 v44.3,10.41
GND  (via drill 0.35)
  Top 0.203: U4.1 20.09,39.28 v20.15,39.28 | C9.2 v4,22.01 | 28.55,34.39 Q1.2 | C6.2 4.15,49.66 v4.25,49.76 | R10.2 21.99,48.66 v21.8,48.85 | U4.7 21.36,44.34 21.05,44.66 v20.85,44.66 | U5.3 20,53.61 v20.3,53.31 | v4.5,43.26 4,43.76 C7.2 | U1.36 40.75,13.01 40,13.76 39.75,13.76
  Top 0.4: B1.- 48.35,35.51 48.35,34.71 | C8.2 v22.7,53.37
  Top 0.5: 50,10.01 51,11.01 | v12.7,18.31 12.7,14.46 11.36,13.12
  Top 1.5: P1.32 50,10.01
  Bottom 0.203: 21.5,19.3 21.5,19.01 22.86,19.01 v22.86,18.82 | v20.15,39.28 18.23,39.28 16,41.51 | 16,49.01 16.8,49.81 | 20.25,49.81 20.35,49.91
  Bottom 0.5: v12.7,18.31 13.4,19.01 21.5,19.01
  other vias: 12.7,17.21 12.7,16.01 12.7,14.91 8.1,13.71 10.2,11.91 11.2,11.91 11.3,10.46 29.5,19.31 31,19.81 31.5,17.81 31.5,15.81 33.5,15.81 33.5,17.81 35.5,17.81 32.5,9.81 33.5,9.81 51.2,16.71 51.2,13.31 50,9.01 50.2,13.31 50.2,16.71 38.9,17.71 38.9,16.41 38.9,19.01 38.9,20.41 40.3,16.41 23.11,19.77 20.15,40.84 9.6,45.91 11.6,45.91 13.6,45.91 13.6,43.91 13.6,41.91 32.5,14.51 35.5,16.31 51,28.01 48.5,21.51 35,9.81 36,9.81 31,8.11 31,9.06 26.5,38.81 49.5,32.51 51,32.51 51,34.01 51,26.01 48.5,26.01 51,21.51 51,19.51 48.5,19.51 47.15,30.61 47.45,32.06 21.76,18.82 10,50.66 12,50.66 14.3,51.51 16.05,51.51 5.25,45.51 38.9,15.16 44.95,16.76 44.45,22.01 44.45,25.51 44.45,23.76 13.25,29.56 13.25,27.06 11.5,26.81 11.93,30.46 13.4,30.46 24.06,19.77 22.36,17.82 18.15,54.46 19.05,53.31 21.85,44.66 27.75,31.31 27.75,29.56 30.5,29.56 35.75,29.56 33.25,29.56 33.25,34.56 39,33.56 37.25,33.56 35.5,33.56 30.5,34.56 30.5,32.81 28.5,36.56 29.88,39.5 30.5,36.56 11.75,29.56 46,8.11 46,9.11 46,10.11 26.75,37.31
  pour Bottom (rank 4): -1,63.01 55,63.01 55,-2.99 -4,-2.99 -4,60.01
  pour Top (rank 6): -1.5,64.01 54.5,64.01 54.5,-3.49 -2.5,-3.49 -2.5,63.01
  pour Top (rank 2): 39.45,33.01 39.45,34.11 38.3,34.11 38.3,33.01
N$1  (via drill 0.35)
  Top 0.2: U2.4 10.6,37.46 9.75,36.61 8.63,36.61 8.14,36.13 v8.14,34.74 | v21.05,36.31 21.6,36.31 22,35.91 SJ3.2
  Bottom 0.2: 8.37,34.97 v8.14,34.74 8.45,35.04 12.4,35.04 13.19,35.83 20.57,35.83 v21.05,36.31
N$3  (via drill 0.35)
  Top 0.203: B1.+ 30.75,53.26 | B1.+ 31.04,51.01 | B1.+ | B1.+ 34.67,49.51 34.75,49.51 | B1.+ 30.79,53.27 v28.8,55.26
  Top 0.4: 25.18,49.04 R1.2 25.05,48.95 24.12,49.88 v24.12,50.67 | B1.+ 30.9,51.21 v30,50.31
  Bottom 0.203: 27.5,54.01 TP3.TP 28.25,55.26 v28.8,55.26
  Bottom 0.4: v24.12,50.67 24.33,50.46 26.14,50.46 27.06,49.53 29.23,49.53 v30,50.31
  pour Top: 29.95,44.46 arc-90 39.73,54.23 arc-90 49.55,44.41 arc-90 39.77,34.64 arc-90
  pour Top: 30.3,51.28 30.3,51.19 30.8,50.69 32.1,49.39 32.95,49.39 34.75,51.19 34.75,51.76 34.75,52.11 33.58,53.28 32.3,54.56 29.8,54.56 29.8,51.78
N$6
  Top 0.2: R2.1 11.4,49.11 U2.20
N$7
  Top 0.2: R2.2 C2.1 9.15,51.91 9.75,52.51 14.25,52.51 X1.P$2
N$8
  Top 0.2: U2.19 12.2,48.46 12.75,49.01 14.45,49.01 15.1,49.66 Z1.1 16.15,50.51 17.4,51.76 17.4,54.96 17.1,55.26 X1.P$1
N$10
  Top 0.2: R10.1 22.7,50.66 22.7,52.16 | R9.2 21.9,51.46 20.3,51.46 20,51.16 U5.8
  Top 0.203: R9.2 22.7,52.16
RA14  (via drill 0.35)
  Top 0.2: U2.15 16.95,45.01 18.4,43.56 18.4,35.26 17.35,34.21 17.35,32.26 v17.77,31.84 | U1.8 43.25,27.95
  Top 0.203: 43.25,27.95 43.25,27.77 v43.66,27.36
  Bottom 0.2: 31.35,26.25 25.69,26.25 22.91,29.03 20.58,29.03 v17.77,31.84
  Bottom 0.203: v43.66,27.36 43.23,27.36 43.22,27.38 42.09,27.38 41.45,26.73 38.12,26.73 37.64,26.25 31.35,26.25
RA15  (via drill 0.35)
  Top 0.2: v43.91,29.39 43.75,29.55 U1.7 | v13.98,33.44 14.53,33.99 14.53,35.43 15.58,36.48 15.58,37.87 v15.28,38.18 | 6.62,40.18 U2.32 9.15,40.21 v9.95,41.01
  Bottom 0.2: v43.91,29.39 43.6,29.09 42.95,29.09 42.66,28.8 41.5,28.8 40.86,28.15 37.53,28.15 37.05,27.67 34.35,27.67 31.57,27.67 31.56,27.66 26.27,27.66 23.5,30.44 21.17,30.44 19.95,31.65 19.95,33.71 19.25,34.42 14.96,34.42 v13.98,33.44 | v15.28,38.18 15.13,38.32 14.04,38.32 11.34,41.01 v9.95,41.01
RA16  (via drill 0.35)
  Top 0.2: v44.43,30.19 44.25,30.37 U1.6 | v13.63,34.32 14.18,34.87 14.18,35.58 15.23,36.63 15.23,37.3 14.62,37.9 14.62,38.85 14.75,38.98 v14.75,38.99 | U2.31 8.98,41.01 v9.95,41.98
  Bottom 0.2: v44.43,30.19 44.28,30.05 43.63,30.05 43.03,29.44 42.8,29.44 42.51,29.15 41.36,29.15 40.71,28.5 37.39,28.5 36.91,28.02 34.21,28.02 31.42,28.02 31.41,28.02 26.41,28.02 23.64,30.79 21.31,30.79 20.3,31.8 20.3,33.91 19.45,34.77 14.07,34.77 v13.63,34.32 | v14.75,38.99 13.86,38.99 11.27,41.59 10.88,41.98 v9.95,41.98
RA17  (via drill 0.35)
  Top 0.2: 44.59,29.01 44.59,29.43 45.08,29.92 45.08,30.46 44.75,30.8 U1.5 | U2.16 16.65,45.81 18.76,43.7 18.76,35.07 17.71,34.03 17.71,33.08 v18.01,32.78
  Top 0.203: 44.59,29.07 44.59,29.01 v44.59,27.12
  Bottom 0.2: 32,26.61 25.83,26.61 23.06,29.38 20.73,29.38 18.43,31.68 18.43,32.11 18.01,32.53 v18.01,32.78
  Bottom 0.203: v44.59,27.12 44.32,27.4 44.32,27.64 43.93,28.02 43.39,28.02 43.1,27.73 41.94,27.73 41.3,27.09 37.98,27.09 37.5,26.61 32,26.61
RA18  (via drill 0.35)
  Top 0.2: v45.26,27.81 45.26,29.59 45.44,29.77 45.44,30.61 45.25,30.79 U1.4 | U2.17 14.94,46.29 16.74,46.29 19.11,43.92 19.11,34.45 v18.41,33.76
  Bottom 0.2: 34.2,26.96 31.86,26.96 31.85,26.96 25.98,26.96 23.2,29.73 20.88,29.73 18.78,31.83 18.78,32.93 18.41,33.3 v18.41,33.76
  Bottom 0.203: v45.26,27.81 44.69,28.38 43.24,28.38 42.95,28.09 41.8,28.09 41.15,27.44 37.83,27.44 37.35,26.96 34.2,26.96
RA19  (via drill 0.35)
  Top 0.2: v45.91,29.01 45.79,29.14 45.79,30.75 45.75,30.79 U1.3 | v5.57,38.65 5.27,38.95 5.27,41.33 5.75,41.81 U2.30
  Bottom 0.2: v45.91,29.01 45.08,29.84 45.08,30.46 44.7,30.85 43.71,30.85 42.36,29.5 41.21,29.5 40.56,28.86 37.24,28.86 36.76,28.38 31.28,28.38 31.27,28.37 26.56,28.37 22.59,32.34 21.66,32.34 21.01,32.98 21.01,34.2 19.74,35.48 13.33,35.48 12.54,34.69 9.02,34.69 8.42,34.08 5.78,34.08 5.12,34.74 5.12,37.5 5.57,37.95 v5.57,38.65
RA20  (via drill 0.35)
  Top 0.2: U2.18 13,48.31 13.3,48.61 14.1,48.61 14.4,48.31 14.4,47.32 15.08,46.64 16.89,46.64 19.47,44.06 19.47,33.61 v19.3,33.44 | U1.46 45.75,13.4
  Top 0.203: 45.75,13.4 46.25,13.9 46.25,26.15 v45.53,26.87
  Bottom 0.2: 34.5,27.32 31.71,27.32 31.71,27.31 26.12,27.31 23.35,30.09 21.02,30.09 19.3,31.81 v19.3,33.44
  Bottom 0.203: v45.53,26.87 45.53,27.15 45.91,27.54 45.91,28.08 45.26,28.73 43.09,28.73 42.8,28.44 41.65,28.44 41,27.8 37.68,27.8 37.2,27.32 34.5,27.32
RAM_/CS  (via drill 0.35)
  Top 0.2: U3.20 19.07,19.47 18.58,19.96 18.58,27.23 17.16,28.65 v17.16,29.17 | v14.44,29.53 14.42,29.55 14.42,32.85 14.89,33.31 14.89,33.53 14.88,33.53 14.88,35.29 15.93,36.34 15.93,39.11 v15.63,39.41 | v9.95,42.91 9.94,42.91 9.44,43.41 U2.28
  Top 0.203: U3.20 20.94,19.47 21.04,19.37 22.68,21.01 C11.1
  Bottom 0.2: v17.16,29.17 14.79,29.17 v14.44,29.53 | v15.63,39.41 15.34,39.41 15.1,39.65 13.75,39.65 10.49,42.91 v9.95,42.91
SND  (via drill 0.35)
  Top 0.2: 48.25,9.71 P1.31 | v44.95,14.46 v44.95,14.45 44.75,14.25 U1.44
  Top 0.203: R8.2 48.25,14.16 v48.25,12.81 48.25,9.71
  Bottom 0.2: v44.95,14.46 46.6,14.46 v48.25,12.81
SRAM_SEL1  (via drill 0.35)
  Top 0.2: U3.26 19.47,27.7 18.63,27.7 18.19,28.14 18.19,29.58 18.3,29.68 v18.3,29.73 | v12.93,33.69 11.82,33.69 10.85,34.67 SJ6.2
  Bottom 0.2: 18.3,30.32 v18.3,29.73
  Bottom 0.203: v12.93,33.69 13.12,33.5 13.12,33.36 13.71,32.78 14.98,32.78 16.92,30.83 17.78,30.83 18.3,30.32
SRAM_SEL2
  Top 0.2: SJ5.2 10.82,31.81 10.82,30.74 9.72,29.63 U3.1
VBAT  (via drill 0.35)
  Top 0.203: U5.10 v21.75,50.36 | U5.10 21.02,50.39 21.02,50.56 21.8,50.56 | U5.10 21,50.16 | 21,50.16 21,49.86 | 21,50.16 21.77,50.16
  Top 0.4: v26.16,49.36 26.01,49.21 26.01,48.19 25.05,47.23 R1.1 25.05,46.33 v24.91,46.19 | v24.73,37.58 24.14,37.58 U4.4
  Bottom 0.203: TP2.TP 27.25,48.76 27,48.76 26.45,49.31 26.26,49.31 26.21,49.36 26.16,49.41
  Bottom 0.4: v24.91,46.19 24.7,45.98 24.7,45.23 24.98,44.96 24.98,44.36 24.14,43.52 24.14,39.78 24.6,39.32 24.6,37.71 v24.73,37.58 | v21.75,50.36 22.2,49.91 25.66,49.91 26.16,49.41 | 26.21,49.36 v26.16,49.36
  pour Top: 21,50.66 21,50.06 22.07,50.06 22.07,50.66
VCC  (via drill 0.35)
  Top 0.203: R8.1 48.15,15.86 48.05,15.96 v48.05,18.66 | 41.1,33.51 41.25,33.36 | SJ1.2 2,51.51 | 33,60.01 33,55.51 | 28.5,42.51 28,43.01 28,46.01
  Top 0.4: 27.76,59.95 27.7,60.01 | 41.25,33.21 41.36,33.1 47.71,33.1 48.5,32.31 C1.1 | U4.8 20.05,43.26 20.05,45.81 C4.1
  Top 0.5: 3,10.01 2,11.01 2,51.51 | 2,59.01 3,60.01 27.7,60.01 33,60.01 43,60.01 47,56.01 50,56.01 51,55.01 51,44.71 | 41.25,34.01 41.25,33.36 41.25,33.21 | v41.1,19.81 41.25,19.66
  Top 1.5: P1.1 3,10.01
  Bottom 0.203: v48.05,18.66 48,18.71 42.7,18.71 41.6,19.81 v41.1,19.81 | TP5.TP 27.55,57.56 v29,57.56
  other vias: 49.15,39.81 44.9,35.31 45.55,34.66 49.15,38.81
  pour Top (rank 2): 3.7,1.01 3.7,7.41 5.4,7.41 5.4,41.21 3.5,43.11 3.5,50.51 4.8,50.51 4.8,55.31 20.4,55.31 20.4,54.81 24.1,54.81 24.1,42.81 20.8,42.81 20.8,43.31 19.5,43.31 19.5,41.56 32,41.56 32,52.26 45.3,52.26 45.3,39.17 53.5,34.55 53.5,62.51 -0.5,62.51 -0.5,1.01
  pour Top (rank 2): 39.85,34.96 39.85,20.66 41.1,19.41 41.1,12.41 41.75,12.41 41.75,16.81 42.1,17.16 42.1,24.46 42.65,25.01 42.6,25.01 41.75,25.86 41.75,33.16 48.65,33.16 48.65,38.76 43.65,38.76
  pour Top: 28.5,47.61 28.5,41.61 27.95,41.61 27.95,47.61
  pour Bottom: 44.23,35.48 45.55,34.16 49.5,38.11 49.5,40.16 48.9,40.16
VCC_SRAM  (via drill 0.35)
  Top 0.203: 8.97,32.19 SJ5.1 8.72,32.44 v8.19,32.44 | U3.28 20.33,30.38 20.22,30.86 20.81,31.46 v21.76,31.46 | 24.95,32.56 24.95,32.46 | 23.18,29.13 C5.1 | U2.24 8.2,51.01 8,51.01 | 6,48.51 C6.1 | U5.1 21,52.56 19.35,52.56 17.75,50.96 17.75,48.16 18.7,47.21 22.8,47.21 22.85,47.16 v22.85,44.71 22.64,44.5 U4.6 22.64,44.5 v22.84,44.71
  Bottom 0.203: v21.76,31.46 20.66,32.56 20.66,34.06 19.59,35.12 13.48,35.12 12.69,34.34 10.11,34.34 8.22,32.44 v8.19,32.44 | TP1.TP 22.7,47.01 23.65,46.06
  other vias: 22.84,45.71 22.84,46.71 23.64,36.41 24.64,36.41 25.64,36.41 15.25,48.76 15.25,47.76 7.25,48.76 7.25,47.76
  pour Top (rank 2): 5.2,53.26 5.2,50.51 5.6,50.51 5.6,47.66 4.05,47.66 4.05,46.26 8.5,46.26 8.5,53.26
  pour Top: 26,37.51 26,29.21 16.5,29.21 16.5,37.51
  pour Top: 21,54.66 22,54.66 22,51.76 20.75,51.76 20,51.01 19,51.01 19,49.76 19.75,49.01 20.75,49.01 21.9,47.86 23.4,47.86 23.5,47.76 23.5,46.56 23.7,46.36 23.7,43.16 22.55,43.16 22.55,46.66 14.5,46.66 14.5,49.01 17.5,52.01 17.5,52.66 21,52.66
  pour Bottom: 22.5,47.01 22.5,40.26 22,39.76 22,38.87 23.35,37.52 23.35,36.11 25.95,36.11 25.95,37.36 24.5,37.36 24.5,39.76 23.75,40.51 23.75,43.76 24.25,44.26 24.25,47.01
  pour Bottom: 15.55,49.06 6.95,49.06 6.95,47.46 15.55,47.46

### Text on the board
tPlace: 64K | SW1 | 256K | NO / REV | REV / A/B
tNames: + | CR2032 | MBC3 | CR2025 | U4 | - | EEPROM | SRAM | 29F016 / 29F032 / 29F033 | 62256 / 6264
tStop: GAME BOY MBC3 CARTRIDGE | 1 | 32
bStop: v1.4 | www.mousebitelabs.com | SUPPORT ORIGINAL CREATORS!